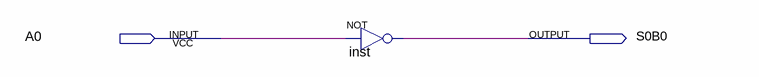
[diagram p0: schematic sheet]
// Quartus schematic S0B0.bdf as structural Verilog: 1 symbols, 2 pins
module S0B0 (
  input  A0,
  output S0B0
);

  not inst (S0B0, A0);
endmodule
